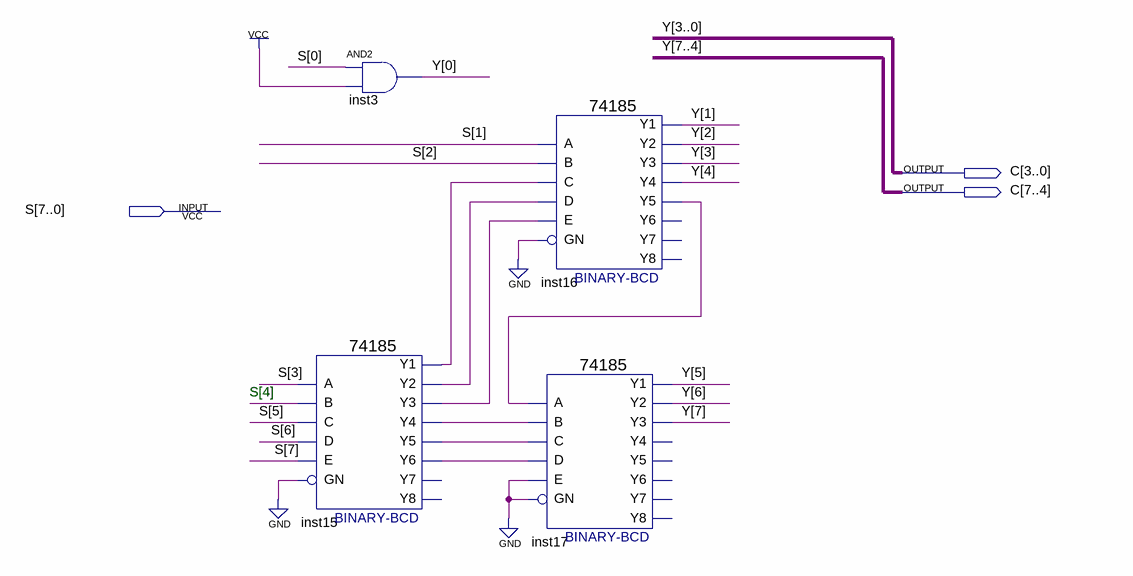
[diagram p0: schematic sheet]
// Quartus schematic 2zhuanbcd.bdf as structural Verilog: 4 symbols, 3 pins
module \2zhuanbcd  (
  input  [7:0] S,
  output [7:0] C
);

  wire inst15_y1, inst15_y2, inst15_y3, inst15_y4, inst15_y5, inst15_y6, inst16_y5;

  and inst3 (C[0], S[0], 1'b1);
  \74185  inst15 (
    .A(S[3]), .B(S[4]), .D(S[6]), .C(S[5]), .E(S[7]), .GN(1'b0), .Y1(inst15_y1), .Y3(inst15_y3),
    .Y2(inst15_y2), .Y5(inst15_y5), .Y4(inst15_y4), .Y6(inst15_y6));  // open: Y8, Y7
  \74185  inst16 (
    .A(S[1]), .B(S[2]), .D(inst15_y2), .C(inst15_y1), .E(inst15_y3), .GN(1'b0), .Y1(C[1]), .Y3(C[3]),
    .Y2(C[2]), .Y5(inst16_y5), .Y4(C[4]));  // open: Y6, Y8, Y7
  \74185  inst17 (
    .A(inst16_y5), .B(inst15_y4), .D(inst15_y6), .C(inst15_y5), .E(1'b0), .GN(1'b0), .Y1(C[5]), .Y3(C[7]),
    .Y2(C[6]));  // open: Y5, Y4, Y6, Y8, Y7

  // Other names for the same wires on the sheet: Y[7:0] = C

  // Notes on the sheet:
  //   S[4]
endmodule
